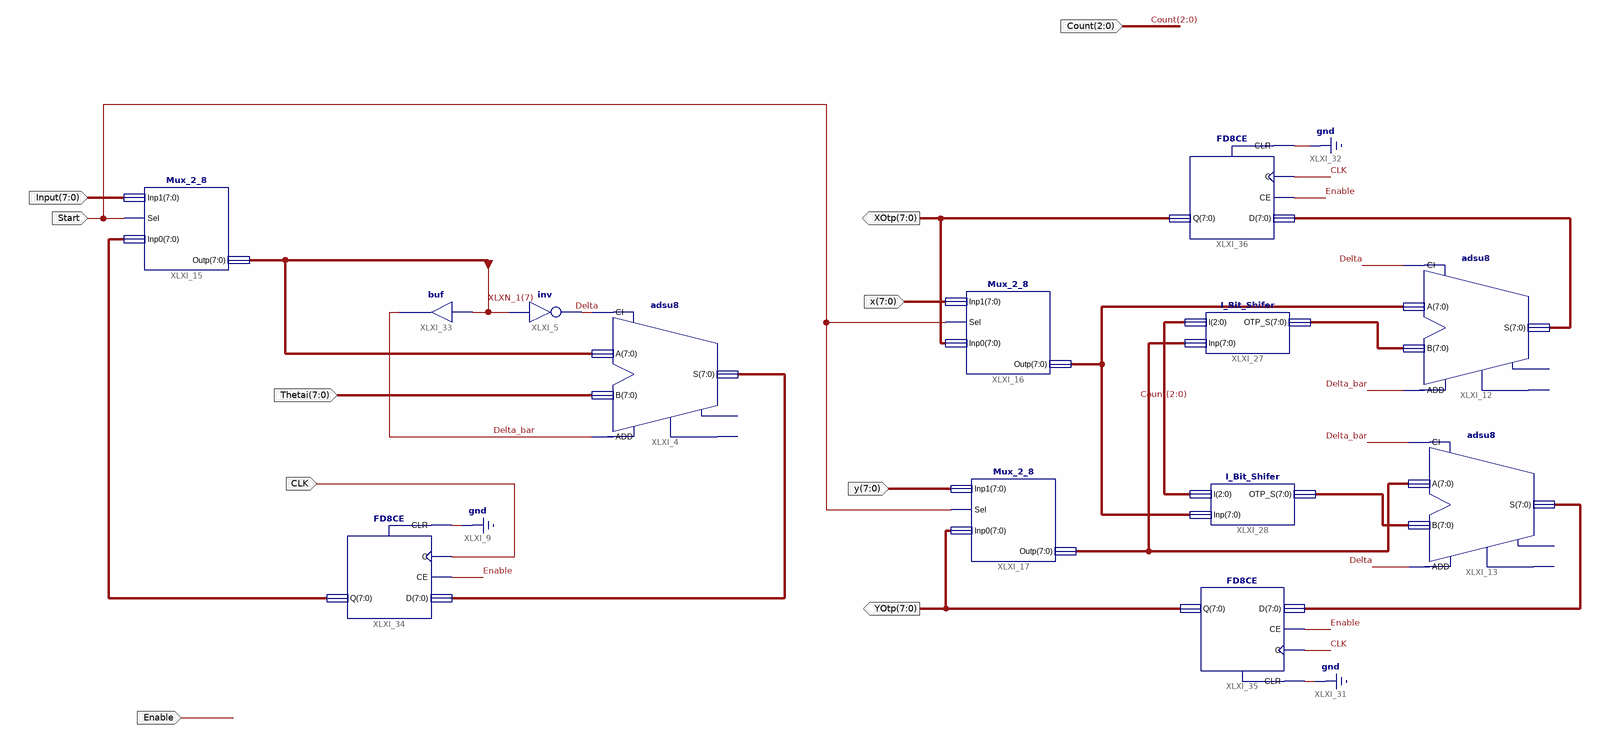
[diagram p0: schematic sheet 1]
// Xilinx ISE schematic Cordic.sch (spartan3e) as structural Verilog: 13 symbols, 10 ports
module Cordic (
  input  [7:0] Thetai,
  input  [7:0] Input,
  input  CLK,
  input  Start,
  input  [2:0] Count,
  input  Enable,
  input  [7:0] y,
  input  [7:0] x,
  output [7:0] XOtp,
  output [7:0] YOtp
);

  wire Delta, Delta_bar;
  wire [7:0] XLXN_1, XLXN_22, XLXN_23, XLXN_56, XLXN_57, XLXN_79, XLXN_81, XLXN_95, XLXN_96;

  adsu8 XLXI_4 (.A(XLXN_1), .ADD(Delta_bar), .B(Thetai), .CI(Delta), .S(XLXN_23));  // open: CO, OFL
  Mux_2_8 XLXI_15 (.Inp1(Input), .Sel(Start), .Inp0(XLXN_22), .Outp(XLXN_1));
  Mux_2_8 XLXI_16 (.Inp1(x), .Sel(Start), .Inp0(XOtp), .Outp(XLXN_56));
  Mux_2_8 XLXI_17 (.Inp1(y), .Sel(Start), .Inp0(YOtp), .Outp(XLXN_57));
  I_Bit_Shifer XLXI_27 (.I(Count), .Inp(XLXN_57), .OTP_S(XLXN_81));
  I_Bit_Shifer XLXI_28 (.I(Count), .Inp(XLXN_56), .OTP_S(XLXN_79));
  adsu8 XLXI_13 (.A(XLXN_57), .ADD(Delta), .B(XLXN_79), .CI(Delta_bar), .S(XLXN_96));  // open: CO, OFL
  adsu8 XLXI_12 (.A(XLXN_56), .ADD(Delta_bar), .B(XLXN_81), .CI(Delta), .S(XLXN_95));  // open: CO, OFL
  not XLXI_5 (Delta, XLXN_1[7]);
  buf XLXI_33 (Delta_bar, XLXN_1[7]);
  FD8CE XLXI_34 (.D(XLXN_23), .CE(Enable), .C(CLK), .CLR(1'b0), .Q(XLXN_22));
  FD8CE XLXI_35 (.D(XLXN_96), .CE(Enable), .C(CLK), .CLR(1'b0), .Q(YOtp));
  FD8CE XLXI_36 (.D(XLXN_95), .CE(Enable), .C(CLK), .CLR(1'b0), .Q(XOtp));
endmodule
